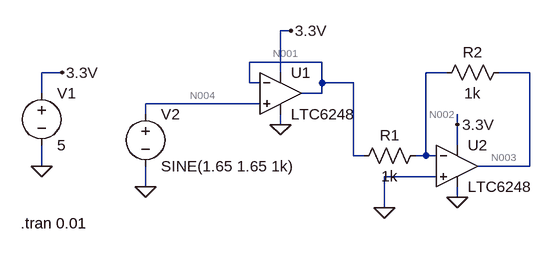
[diagram p0: schematic Draft1.asc]
* Draft1.asc
* U1: LTC6248 (symbol OpAmps\LTC6248 not available, pins judged from their places): In+=N004 In-=N001 V+=3.3V V-=0 OUT=N001
* U2: LTC6248 (symbol OpAmps\LTC6248 not available, pins judged from their places): In+=0 In-=N002 V+=3.3V V-=0 OUT=N003
V1 3.3V 0 5
V2 N004 0 SINE(1.65 1.65 1k)
R1 N002 N001 1k
R2 N003 N002 1k
.tran 0.01
.backanno
.end

* Results of the author's LTspice run, read from the files saved beside the schematic
* Operating Point, zero values left out:
*   V(n004) = 1.65 V
*   V(n003) = 35.88 mV
*   V(n002) = 830 mV
*   V(n001) = 1.65 V
*   V(3.3v) = 5 V
*   I(R2) = -794.2 µA
*   I(V2) = 82.79 nA
*   I(V1) = -2.728 mA
*   I(R1) = -819.9 µA
*   Ix(u2:1) = 794.2 µA
*   Ix(u2:2) = -2.012 mA
*   Ix(u2:3) = -26.14 µA
*   Ix(u2:4) = 25.79 µA
*   Ix(u2:5) = 1.218 mA
*   Ix(u1:1) = -819.9 µA
*   Ix(u1:2) = -689.8 µA
*   Ix(u1:3) = -82.79 nA
*   Ix(u1:4) = -83.99 nA
*   Ix(u1:5) = 1.51 mA
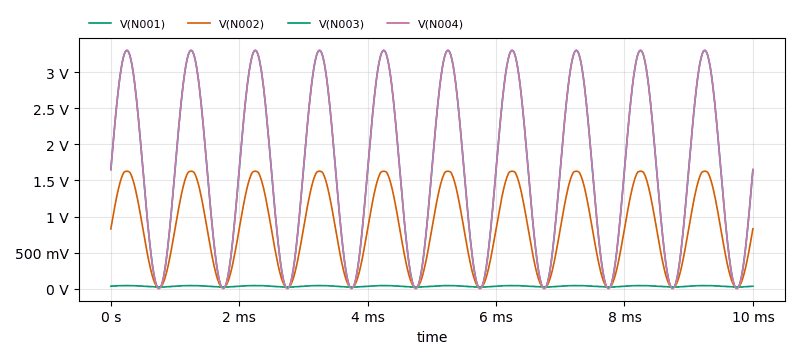
[diagram p1: Transient Analysis of Draft1.asc, plotted from the saved traces]
* Transient Analysis, 1 run:
*   V(N001): min 24.16 mV, max 3.3 V, average 1.651 V, rms 2.021 V, last 1.65 V
*   V(N002): min 23.91 mV, max 1.628 V, average 828.8 mV, rms 1.009 V, last 830 mV
*   V(N003): min 24.2 mV, max 44.42 mV, average 35.09 mV, rms 35.82 mV, last 35.88 mV
*   V(N004): min 6.741 µV, max 3.3 V, average 1.65 V, rms 2.021 V, last 1.65 V